# EAGLE design MegaShieldTopMounted (EAGLE 5.11)
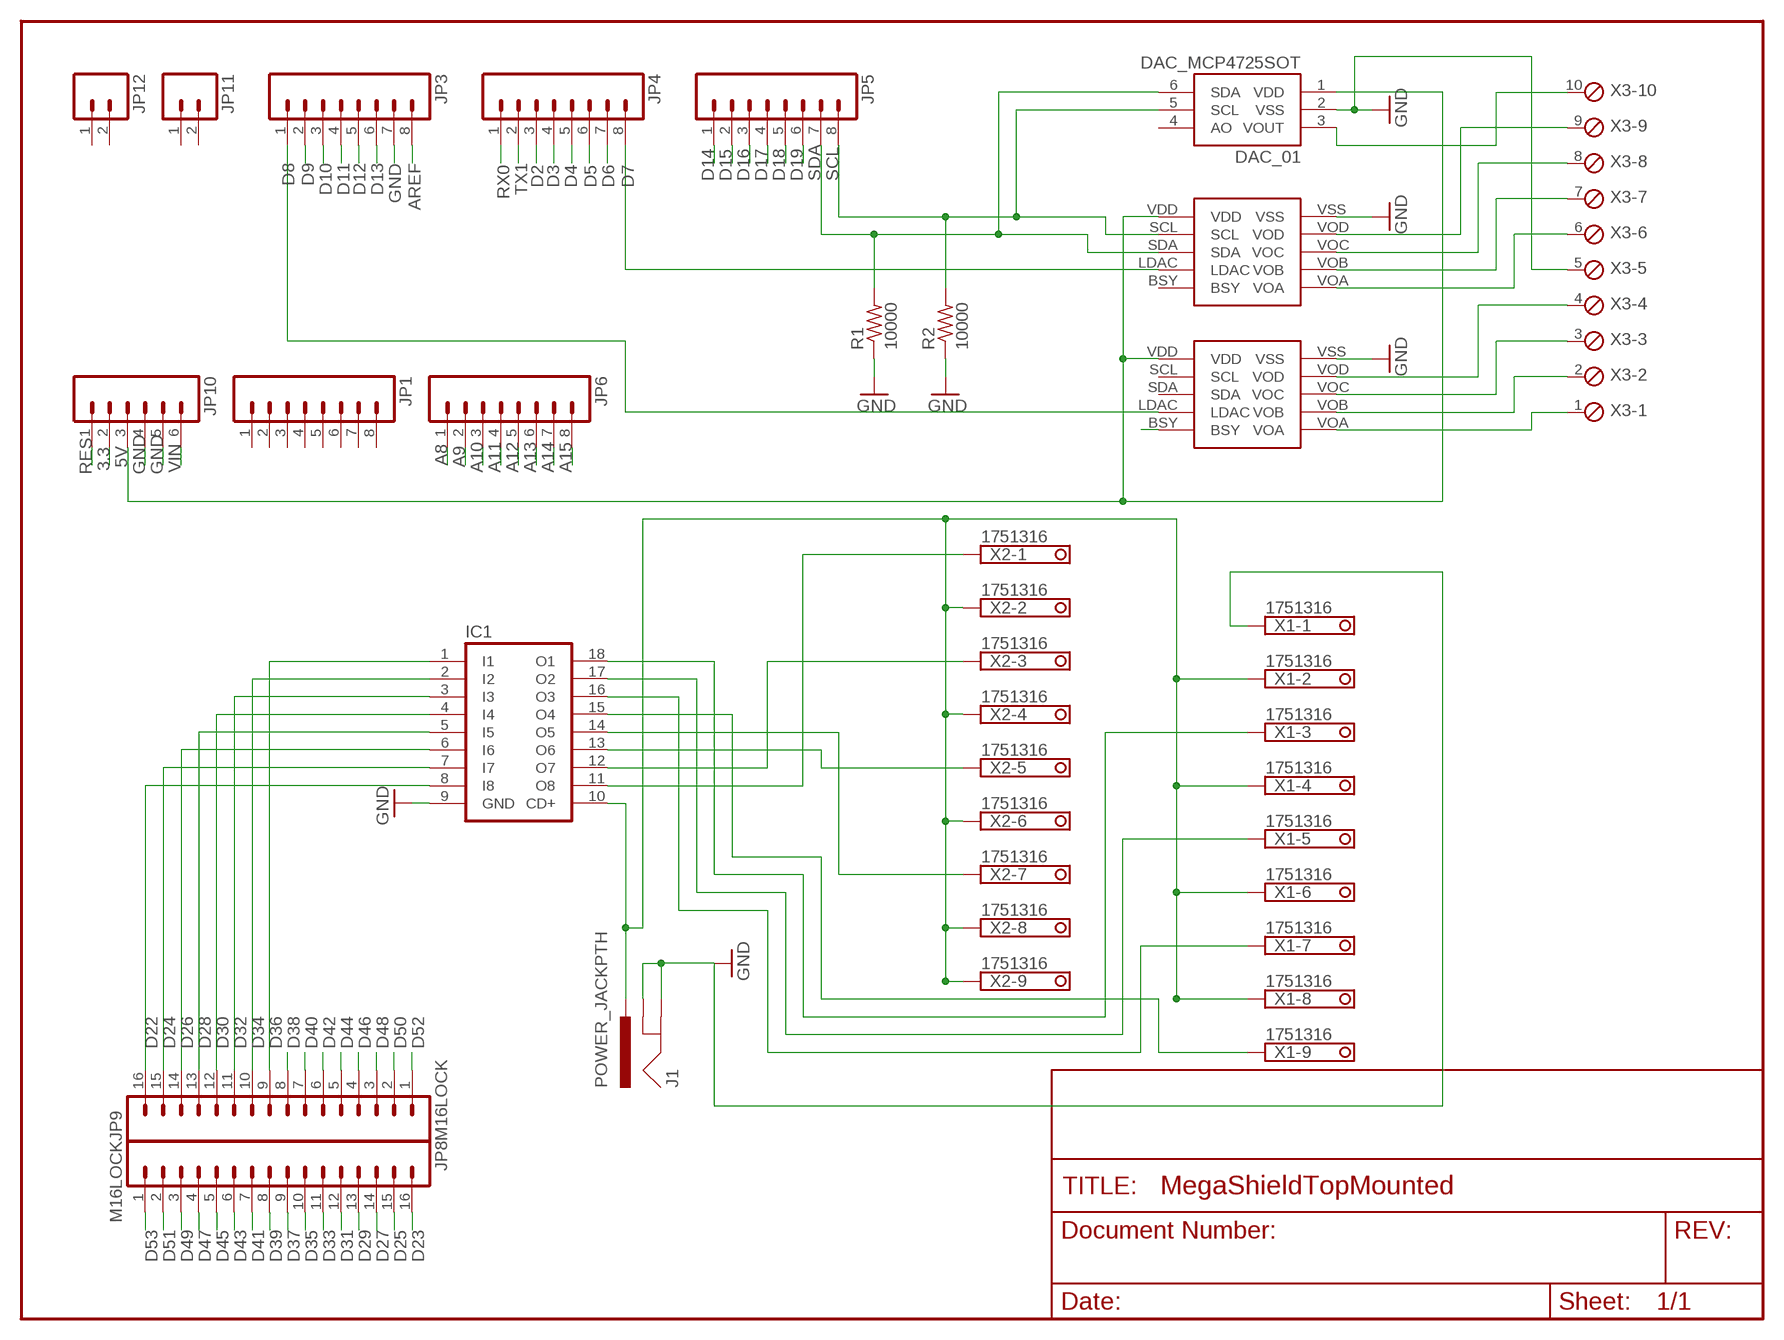
[diagram p0: schematic, sheet 1]

## Parts
DAC_01  DAC_MCP4725SOT  [SOT23-6]
IC1  ULN2803A  [DIL18]
J1  POWER_JACKPTH  [POWER_JACK_PTH]
JP1  M08LOCK  [1X08_LOCK]
JP3  M08LOCK  [1X08_LOCK]
JP4  M08LOCK  [1X08_LOCK]
JP5  M08LOCK  [1X08_LOCK]
JP6  M08LOCK  [1X08_LOCK]
JP8  M16LOCK  [1X16_LOCK]
JP9  M16LOCK  [1X16_LOCK]
JP10  M06LOCK  [1X06_LOCK]
JP11  M02LOCK  [1X02_LOCK]
JP12  M02LOCK  [1X02_LOCK]
R1  10000  R-US_0204/7  [0204/7]
R2  10000  R-US_0204/7  [0204/7]
U$1  MCP4728  [MCP4728]
U$2  MCP4728  [MCP4728]
X1  1751316  [1751316]
X2  1751316  [1751316]
X3  MPT10  [10POL254]

## Nets
3.3: JP10.2
5V: DAC_01.1(VDD) JP10.3 U$1.VDD U$2.VDD
A8: JP6.1
A9: JP6.2
A10: JP6.3
A11: JP6.4
A12: JP6.5
A13: JP6.6
A14: JP6.7
A15: JP6.8
AREF: JP3.8
D2: JP4.3
D3: JP4.4
D4: JP4.5
D5: JP4.6
D6: JP4.7
D7: JP4.8 U$1.LDAC
D8: JP3.1 U$2.LDAC
D9: JP3.2
D10: JP3.3
D11: JP3.4
D12: JP3.5
D13: JP3.6
D14: JP5.1
D15: JP5.2
D16: JP5.3
D17: JP5.4
D18: JP5.5
D19: JP5.6
D22: IC1.8(I8) JP9.16
D23: JP8.16
D24: IC1.7(I7) JP9.15
D25: JP8.15
D26: IC1.6(I6) JP9.14
D27: JP8.14
D28: IC1.5(I5) JP9.13
D29: JP8.13
D30: IC1.4(I4) JP9.12
D31: JP8.12
D32: IC1.3(I3) JP9.11
D33: JP8.11
D34: IC1.2(I2) JP9.10
D35: JP8.10
D36: IC1.1(I1) JP9.9
D37: JP8.9
D38: JP9.8
D39: JP8.8
D40: JP9.7
D41: JP8.7
D42: JP9.6
D43: JP8.6
D44: JP9.5
D45: JP8.5
D46: JP9.4
D47: JP8.4
D48: JP9.3
D49: JP8.3
D50: JP9.2
D51: JP8.2
D52: JP9.1
D53: JP8.1
GND: DAC_01.2(VSS) IC1.9(GND) J1.GND J1.GNDBREAK JP3.7 JP10.4 JP10.5 R1.1 R2.1 U$1.VSS U$2.VSS X1.1 X3.5
N$1: IC1.10(CD+) J1.PWR X1.2 X1.4 X1.6 X1.8 X2.2 X2.4 X2.6 X2.8 X2.9
N$2: IC1.11(O8) X2.1
N$3: IC1.12(O7) X2.3
N$4: IC1.13(O6) X2.5
N$5: IC1.14(O5) X2.7
N$6: U$1.VOD X3.9
N$7: IC1.16(O3) X1.7
N$8: U$1.VOC X3.8
N$9: U$1.VOB X3.7
N$10: U$1.VOA X3.6
N$11: DAC_01.3(VOUT) X3.10
N$15: U$2.VOD X3.4
N$16: U$2.VOC X3.3
N$17: U$2.VOB X3.2
N$18: U$2.VOA X3.1
N$23: U$2.BSY
N$42: IC1.17(O2) X1.5
N$43: IC1.18(O1) X1.3
N$44: IC1.15(O4) X1.9
RES: JP10.1
RX0: JP4.1
SCL: DAC_01.5(SCL) JP5.8 R2.2 U$1.SCL
SDA: DAC_01.6(SDA) JP5.7 R1.2 U$1.SDA
TX1: JP4.2
VIN: JP10.6
Unconnected: DAC_01.4(AO) JP1.1 JP1.2 JP1.3 JP1.4 JP1.5 JP1.6 JP1.7 JP1.8 JP11.1 JP11.2 JP12.1 JP12.2 U$1.BSY U$2.SCL U$2.SDA

## Library data of the parts
DAC_01 = SparkFun:DAC_MCP4725
IC1 = uln-udn:ULN2803A: DRIVER ARRAY
J1 = SparkFun:POWER_JACK: Power Jack This is the standard 5.5mm barrel jack for power. The PTH is the most common, proven, reliable, footprint. All others are experimental. The Slot footprint only works if the mill layer is transmitted to the PCB fab house so be warned. Spark Fun Electronics SKU : PRT-00119. Mating wall wart : TOL-00298 (and others)
JP1 JP3-JP6 = SparkFun:M08: Header 8 Standard 8-pin 0.1" header. Use with straight break away headers (SKU : PRT-00116), right angle break away headers (PRT-00553), swiss pins (PRT-00743), machine pins (PRT-00117), and female headers (PRT-00115).
JP8 JP9 = SparkFun:M16
JP10 = SparkFun:M06: Header 6 Standard 6-pin 0.1" header. Use with straight break away headers (SKU : PRT-00116), right angle break away headers (PRT-00553), swiss pins (PRT-00743), machine pins (PRT-00117), and female headers (PRT-00115). Molex polarized connector foot print use with SKU : PRT-08094 with associated crimp pins and housings. NOTES ON THE VARIANTS LOCK and LOCK_LONGPADS... This footprint was designed to help hold the alignment of a through-hole component (i.e. 6-pin header) while soldering it into place. You may notice that each hole has been shifted either up or down by 0.005 of an inch from it's more standard position (which is a perfectly straight line). This slight alteration caused the pins (the squares in the middle) to touch the edges of the holes. Because they are alternating, it causes a "brace" to hold the component in place. 0.005 has proven to be the perfect amount of "off-center" position when using our standard breakaway headers. Although looks a little odd when you look at the bare footprint, once you have a header in there, the alteration is very hard to notice. Also, if you push a header all the way into place, it is covered up entirely on the bottom side. This idea of altering the position of holes to aid alignment will be further integrated into the Sparkfun Library for other footprints. It can help hold any component with 3 or more connection pins.
JP11 JP12 = SparkFun:M02: Header 2 Standard 2-pin 0.1" header. Use with straight break away headers (SKU : PRT-00116), right angle break away headers (PRT-00553), swiss pins (PRT-00743), machine pins (PRT-00117), and female headers (PRT-00115). Molex polarized connector foot print use with SKU : PRT-08233 with associated crimp pins and housings.
R1 R2 = rcl:R-US_: RESISTOR, American symbol
U$1 U$2 = TravLib:MCP4728
X1 X2 = con-phoenix-350:1751316: MKDS 1/ 9-3,5 Printklemme Nennstrom: 10 A Bemessungsspannung: 160 V Raster: 3,5 mm Polzahl: 9 Montageart: Löten Anschlussart: Schraubanschluss Anschlussrichtung vom Leiter zur Platine: 0° Source: http://eshop.phoenixcontact.com .. 1751316.pdf; OC_FARNELL: unknown; OC_NEWARK: unknown
X3 = con-phoenix-254:MPT10: PHOENIX CONNECTOR; OC_FARNELL: unknown; OC_NEWARK: unknown

## Board
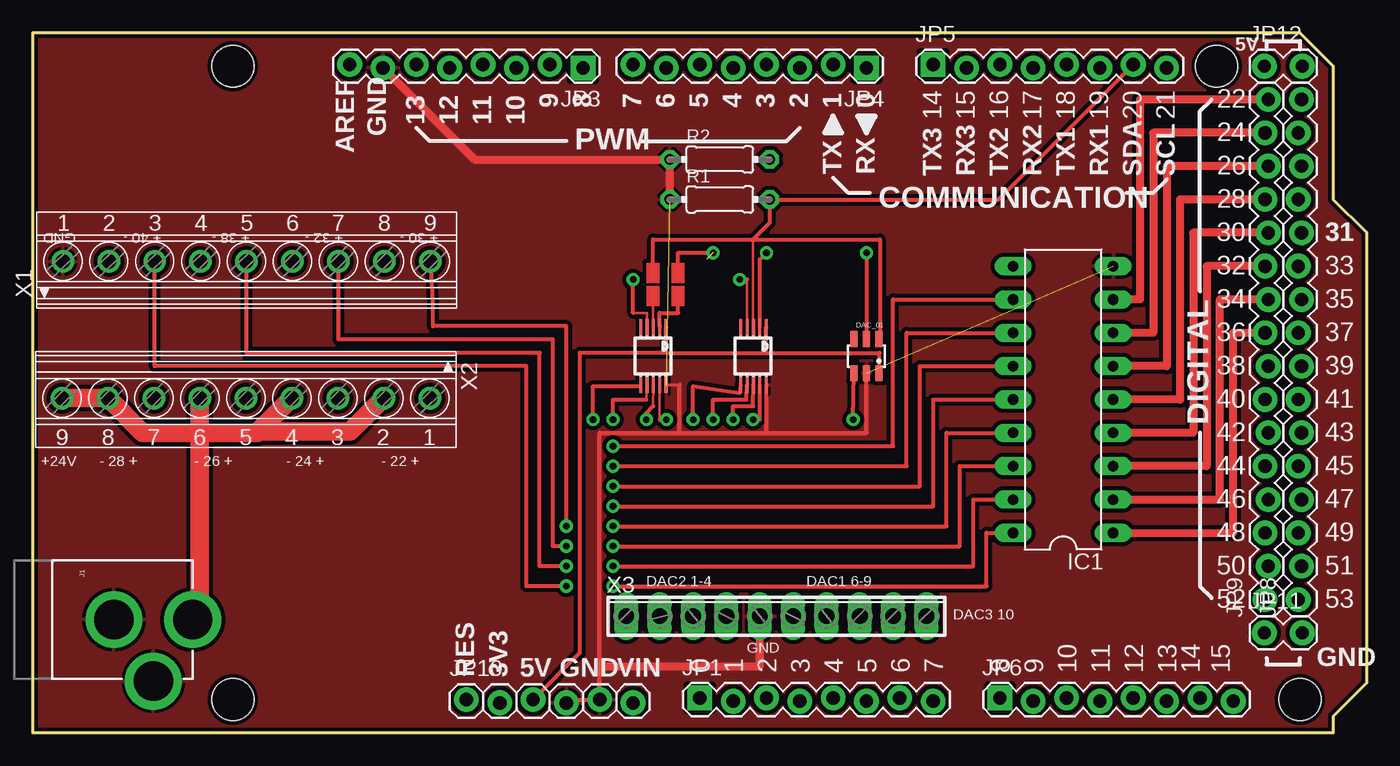
[diagram p1: board, top side]
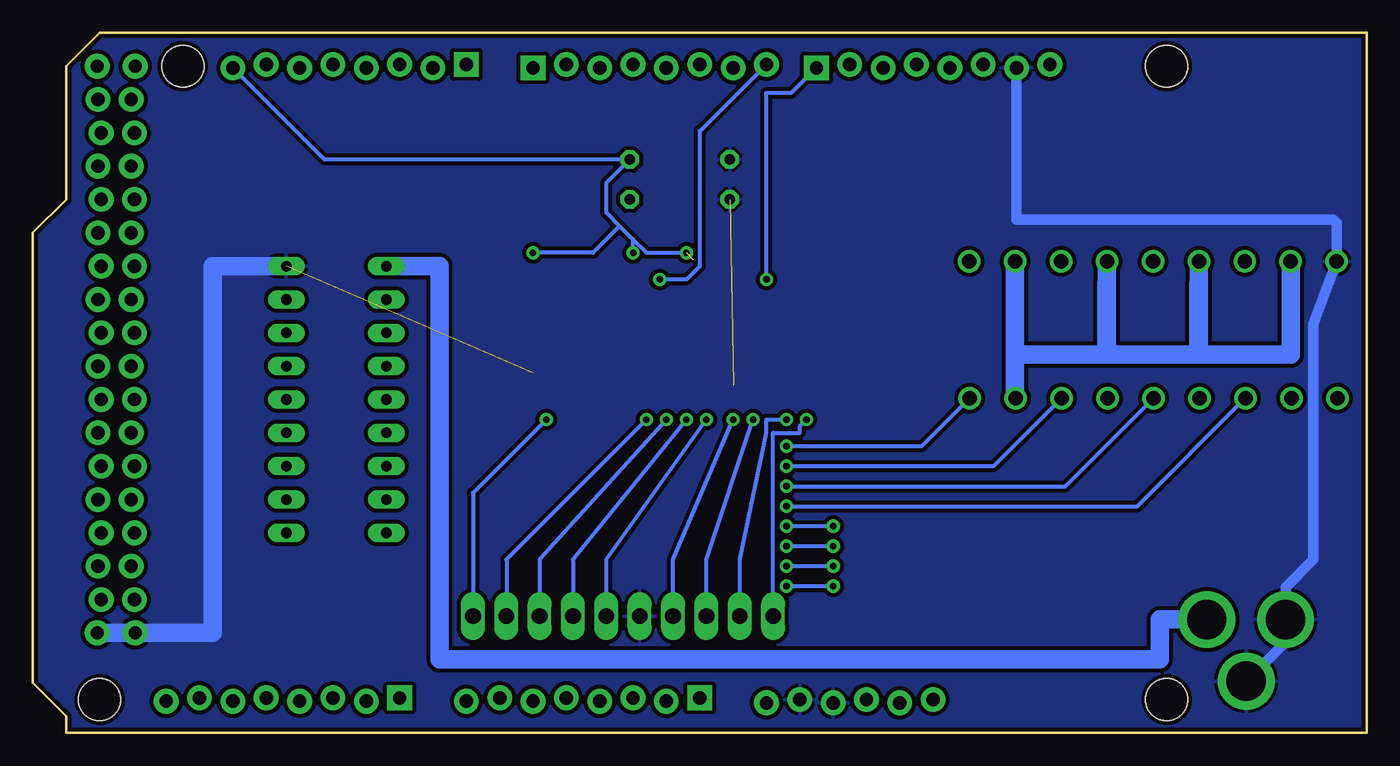
[diagram p2: board, bottom side, seen from below]

Size 101.6 x 53.34 mm. Coordinates in mm from the lower left corner, seen from the top.
Outline: 0,0 99.06,0 99.06,1.27 101.6,3.81 101.6,38.1 99.06,40.64 99.06,50.8 96.52,53.34 0,53.34 0,0
Copper layers (1*16): Top 0.035mm / dielectric 1.5mm / Bottom 0.035mm
Design rules "SparkFun": minimum track width 8mil, minimum drill 20mil, track to track 8mil, track to pad 8mil, pad to pad 8mil, via to via 8mil, smd to smd 8mil, copper to edge 10mil, drill to drill 8mil, minimum pad ring 12mil, minimum via ring 10mil, stop-mask expansion 4mil, vias tented up to drill 25mil, thermal gap 10mil
Holes 3.2 mm at 15.24,50.8 15.24,2.54 90.17,50.8 96.52,2.54

### Footprints (pad centres in the part's own frame; a part is rotated, then mirrored left to right if it is on the bottom)
SOT23-6 = smd 0.55 x 1.2: 1 0.95,-1.3; 2 0,-1.3; 3 -0.95,-1.3; 4 -0.95,1.3; 5 0,1.3; 6 0.95,1.3
DIL18 = drill 0.813 long: 1 -10.16,-3.81; 2 -7.62,-3.81; 3 -5.08,-3.81; 4 -2.54,-3.81; 5 0,-3.81; 6 2.54,-3.81; 7 5.08,-3.81; 8 7.62,-3.81; 9 10.16,-3.81; 10 10.16,3.81; 11 7.62,3.81; 12 5.08,3.81; 13 2.54,3.81; 14 0,3.81; 15 -2.54,3.81; 16 -5.08,3.81; 17 -7.62,3.81; 18 -10.16,3.81
POWER_JACK_PTH = drill 2.997 pad 4.318 round: GND 0,7.7; GNDBREAK 4.7,10.7; PWR 0,13.7
1X08_LOCK = drill 1.016 pad 1.88 square: 1 0,0.127 | drill 1.016 pad 1.88 round: 2 2.54,-0.127; 3 5.08,0.127; 4 7.62,-0.127; 5 10.16,0.127; 6 12.7,-0.127; 7 15.24,0.127; 8 17.78,-0.127
1X16_LOCK = drill 1.016 pad 1.88 round: 1 0,0.127; 2 2.54,-0.127; 3 5.08,0.127; 4 7.62,-0.127; 5 10.16,0.127; 6 12.7,-0.127; 7 15.24,0.127; 8 17.78,-0.127; 9 20.32,0.127; 10 22.86,-0.127; 11 25.4,0.127; 12 27.94,-0.127; 13 30.48,0.127; 14 33.02,-0.127; 15 35.56,0.127; 16 38.1,-0.127
1X06_LOCK = drill 1.016 pad 1.88 round: 1 0,0; 2 2.54,-0.254; 3 5.08,0; 4 7.62,-0.254; 5 10.16,0; 6 12.7,-0.254
1X02_LOCK = drill 1.016 pad 1.88 round: 1 -0.178,0; 2 2.718,0
0204/7 = drill 0.813 octagon: 1 -3.81,0; 2 3.81,0
MCP4728 = smd 1.27 x 0.203: BSY -2.184,-0.94; LDAC -2.184,-0.457; SCL -2.184,0.508; SDA -2.184,0.025; VDD -2.184,0.991; VOA 2.184,-0.94; VOB 2.184,-0.457; VOC 2.184,0.025; VOD 2.184,0.508; VSS 2.184,0.991
1751316 = drill 1.1 pad 1.7 round: 1 -13.973,-0.1; 2 -10.473,-0.1; 3 -6.973,-0.1; 4 -3.473,-0.1; 5 0.028,-0.1; 6 3.527,-0.1; 7 7.027,-0.1; 8 10.527,-0.1; 9 14.027,-0.1
10POL254 = drill 1.2 long: 1 -11.43,0; 2 -8.89,0; 3 -6.35,0; 4 -3.81,0; 5 -1.27,0; 6 1.27,0; 7 3.81,0; 8 6.35,0; 9 8.89,0; 10 11.43,0

### Placement (x,y rotation side)
DAC_01  63.5,28.7 0 top
IC1  78.49,25.4 90 top
J1  -1.52,8.64 270 top
JP1  50.8,2.54 0 top
JP3  41.91,50.8 180 top
JP4  63.5,50.8 180 top
JP5  68.58,50.8 0 top
JP6  73.66,2.54 0 top
JP8  96.52,10.16 90 top
JP9  93.98,10.16 90 top
JP10  33.02,2.54 0 top
JP11  93.98,7.62 0 top
JP12  93.98,50.8 0 top
R1  52.32,40.64 0 top
R2  52.32,43.69 0 top
U$1  54.86,28.7 270 top
U$2  47.24,28.7 270 top
X1  16.26,36.02 0 top
X2  16.26,25.4 180 top
X3  56.64,8.89 0 top

### Tracks (layer width: path | path; a pad name or v marks a point on that pad's centre or on a via)
5V
  Top 0.305: U$2.VDD 48.23,28.98 48.26,28.96 | U$1.VDD 55.85,28.98 55.88,28.96 | 48.26,28.96 55.88,28.96 | DAC_01.1 64.45,28.89 64.52,28.96 55.88,28.96 | 48.26,28.96 41.66,28.96 41.66,6.1 JP10.3
D7  (via drill 0.5 pad 0.25)
  Top 0.203: 54.41,34.54 U$1.LDAC
  Top 0.305: v53.85,34.54 54.41,34.54
  Bottom 0.305: v53.85,34.54 51.82,34.54 50.8,35.56 50.8,45.85 JP4.8
D8  (via drill 0.5 pad 0.25)
  Top 0.203: 45.72,32 46.79,32 U$2.LDAC
  Top 0.305: 45.72,32 v45.72,34.54
  Bottom 0.305: v45.72,34.54 45.72,48.77 43.81,48.77 JP3.1
D22
  Top 0.61: JP9.16 84.33,48.26 84.33,33.02 IC1.8
D24
  Top 0.61: JP9.15 85.34,45.72 85.34,30.48 IC1.7
D26
  Top 0.61: JP9.14 86.36,43.18 86.36,27.94 IC1.6
D28
  Top 0.61: JP9.13 87.38,40.64 87.38,25.4 IC1.5
D30
  Top 0.61: JP9.12 88.39,38.1 88.39,22.86 IC1.4
D32
  Top 0.61: JP9.11 89.41,35.56 89.41,20.32 IC1.3
D34
  Top 0.61: IC1.2 90.42,17.78 90.42,33.02 JP9.10
D36
  Top 0.61: IC1.1 91.44,15.24 91.44,30.48 JP9.9
GND  (2 unrouted)
  Top 0.203: 49.28,26.52 U$2.VSS
  Top 0.305: JP10.4 40.89,2.54 JP10.5 43.18,5.08 43.18,22.86 49.28,22.86 | U$1.VSS 55.88,26.52 55.88,22.86 | DAC_01.2 63.5,22.86 55.88,22.86 | 49.28,22.86 55.88,22.86 | 49.28,22.86 49.28,26.52
  Top 0.61: R1.1 R2.1 33.66,43.69 JP3.7 | X3.5 55.37,5.08 43.18,5.08
  Bottom 0.813: JP3.7 26.67,39.12 2.54,39.12 2.28,38.86 X1.1 4.06,31.14 4.06,13.21 6.18,11.1 J1.GND 6.18,6.94 J1.GNDBREAK
  Bottom 1.422: IC1.9 87.88,35.56 87.88,7.62 96.52,7.62
  pour Bottom (isolate 0.305): 0,0 99.06,0 99.06,1.27 101.6,3.81 101.6,38.1 99.06,40.64 99.06,50.8 96.52,53.34 0,53.34 0,2.54
  pour Top (isolate 0.305): 0,0 99.06,0 99.06,1.27 101.6,3.81 101.6,38.1 99.06,40.64 99.06,50.8 96.52,53.34 0,53.34 0,2.54
N$1
  Top 1.422: J1.PWR 12.73,9.19 12.73,22.86 | 12.73,22.86 X2.6 | 12.73,22.86 8.37,22.86 X2.8 5.63,25.4 5.59,25.4 5.49,25.5 X2.9 | 17.18,22.95 17.09,22.86 12.73,22.86 | 17.18,22.95 X2.4 | X2.2 24.18,22.95 17.18,22.95
  Bottom 1.422: J1.PWR 15.75,8.64 15.75,5.59 70.61,5.59 70.61,35.56 IC1.10 | X2.2 26.78,25.5 X1.8 26.8,32.92 26.8,28.83 19.81,28.83 | 19.81,28.83 19.78,28.83 | 19.78,28.83 X1.6 19.81,32.92 19.81,28.83 | 19.78,28.83 12.83,28.83 | 12.83,28.83 12.78,28.83 | 12.78,28.83 X1.4 12.83,32.92 12.83,28.83 | 12.78,28.83 5.78,28.83 X1.2
N$2  (via drill 0.5 pad 0.25)
  Top 0.305: IC1.11 65.53,33.02 65.53,21.84 v44.2,21.84
  Bottom 0.305: v44.2,21.84 33.88,21.84 X2.1
N$3  (via drill 0.5 pad 0.25)
  Top 0.305: IC1.12 66.55,30.48 66.55,20.32 v44.2,20.32
  Bottom 0.305: v44.2,20.32 28.41,20.32 X2.3
N$4  (via drill 0.5 pad 0.25)
  Top 0.305: IC1.13 67.56,27.94 67.56,18.8 v44.2,18.8
  Bottom 0.305: v44.2,18.8 22.93,18.8 X2.5
N$5  (via drill 0.5 pad 0.25)
  Top 0.305: IC1.14 68.58,25.4 68.58,17.27 v44.2,17.27
  Bottom 0.305: v44.2,17.27 17.46,17.27 X2.7
N$6  (via drill 0.5 pad 0.25)
  Top 0.305: U$1.VOD 55.37,23.88 v54.86,23.88
  Bottom 0.305: v54.86,23.88 65.53,13.21 X3.9
N$7  (via drill 0.5 pad 0.25)
  Top 0.305: IC1.16 70.61,20.32 70.61,14.22 v44.2,14.22 | v40.64,14.22 39.62,14.22 39.62,29.97 23.28,29.97 X1.7
  Bottom 0.305: v40.64,14.22 v44.2,14.22
N$8  (via drill 0.5 pad 0.25)
  Top 0.305: U$1.VOC 54.86,24.89 53.34,24.89 v53.34,23.88
  Bottom 0.305: v53.34,23.88 62.99,13.21 X3.8
N$9  (via drill 0.5 pad 0.25)
  Top 0.305: U$1.VOB 54.36,25.4 51.82,25.4 v51.82,23.88
  Bottom 0.305: v51.82,23.88 60.45,13.21 X3.7
N$10  (via drill 0.5 pad 0.25)
  Top 0.305: v50.29,23.88 50.29,26.42 53.85,25.91 U$1.VOA
  Bottom 0.305: v50.29,23.88 57.91,13.21 X3.6
N$11  (via drill 0.5 pad 0.25)
  Top 0.305: v62.48,23.88 DAC_01.3
  Bottom 0.305: v62.48,23.88 68.07,18.29 X3.10
N$12  (via drill 0.5 pad 0.25)
  Top 0.305: 49.15,35.31 49.15,36.58 v51.82,36.58
N$13  (via drill 0.5 pad 0.25)
  other vias: 55.88,36.58
N$14  (via drill 0.5 pad 0.25)
  other vias: 63.5,36.58
N$15  (via drill 0.5 pad 0.25)
  Top 0.203: U$2.VOD 47.75,23.88
  Top 0.305: v48.26,23.88 47.75,23.88
  Bottom 0.305: v48.26,23.88 52.83,13.21 X3.4
N$16  (via drill 0.5 pad 0.25)
  Top 0.203: 47.24,24.89 U$2.VOC
  Top 0.305: 47.24,24.89 46.74,24.38 v46.74,23.88
  Bottom 0.305: v46.74,23.88 50.29,13.21 X3.3
N$17  (via drill 0.5 pad 0.25)
  Top 0.203: 46.74,25.4 U$2.VOB
  Top 0.305: 46.74,25.4 44.2,25.4 v44.2,23.88
  Bottom 0.305: v44.2,23.88 45.72,23.88 45.72,22.86 47.75,13.21 X3.2
N$18  (via drill 0.5 pad 0.25)
  Top 0.203: 46.2,26.42 U$2.VOA
  Top 0.305: 46.2,26.42 42.67,26.42 v42.67,23.88
  Bottom 0.305: v42.67,23.88 43.18,23.37 43.18,22.86 45.21,22.86 X3.1
N$19  (via drill 0.5 pad 0.25)
  other vias: 45.72,34.54 53.85,34.54
N$22
  Top 0.203: 47.24,31.5 47.24,32.77
N$24
  Top 0.305: 47.75,30.99 47.75,32 49.15,32 49.15,32.89
N$25  (via drill 0.5 pad 0.25)
  other vias: 54.86,23.88
N$26  (via drill 0.5 pad 0.25)
  other vias: 53.34,23.88
N$27  (via drill 0.5 pad 0.25)
  other vias: 51.82,23.88
N$28  (via drill 0.5 pad 0.25)
  other vias: 50.29,23.88
N$29  (via drill 0.5 pad 0.25)
  other vias: 48.26,23.88
N$30  (via drill 0.5 pad 0.25)
  other vias: 46.74,23.88
N$31  (via drill 0.5 pad 0.25)
  other vias: 44.2,23.88
N$32  (via drill 0.5 pad 0.25)
  other vias: 42.67,23.88
N$33  (via drill 0.5 pad 0.25)
  other vias: 62.48,23.88
N$34  (via drill 0.5 pad 0.25)
  other vias: 44.2,21.84
N$35  (via drill 0.5 pad 0.25)
  other vias: 44.2,20.32
N$36  (via drill 0.5 pad 0.25)
  other vias: 44.2,18.8
N$37  (via drill 0.5 pad 0.25)
  other vias: 44.2,17.27
N$38  (via drill 0.5 pad 0.25)
  other vias: 44.2,15.75
N$39  (via drill 0.5 pad 0.25)
  other vias: 44.2,14.22
N$40  (via drill 0.5 pad 0.25)
  other vias: 44.2,12.7
N$41  (via drill 0.5 pad 0.25)
  other vias: 44.2,11.18
N$42  (via drill 0.5 pad 0.25)
  Top 0.305: IC1.17 71.63,17.78 71.63,12.7 v44.2,12.7 | v40.64,12.7 38.61,12.7 38.61,28.96 16.28,28.96 X1.5
  Bottom 0.305: v40.64,12.7 v44.2,12.7
N$43  (via drill 0.5 pad 0.25)
  Top 0.305: IC1.18 72.64,15.24 72.64,11.18 v44.2,11.18 | v40.64,11.18 37.59,11.18 37.59,27.94 9.28,27.94 X1.3
  Bottom 0.305: v40.64,11.18 v44.2,11.18
N$44  (via drill 0.5 pad 0.25)
  Top 0.305: IC1.15 69.6,22.86 69.6,15.75 v44.2,15.75 | v40.64,15.75 40.64,30.99 30.48,30.99 30.48,32.92 X1.9
  Bottom 0.305: v40.64,15.75 v44.2,15.75
N$45  (via drill 0.5 pad 0.25)
  other vias: 40.64,15.75
N$46  (via drill 0.5 pad 0.25)
  other vias: 40.64,14.22
N$47  (via drill 0.5 pad 0.25)
  other vias: 40.64,12.7
N$48  (via drill 0.5 pad 0.25)
  other vias: 40.64,11.18
SCL  (via drill 0.5 pad 0.25)  (1 unrouted)
  Top 0.305: U$1.SCL 55.37,36.07 v55.88,36.58 | v63.5,36.58 DAC_01.5
  Bottom 0.305: JP5.8 79.38,43.69 R2.2 57.91,41.91 57.91,39.62 56.9,38.61 | 55.88,37.59 54.86,36.58 v51.82,36.58 | v55.88,36.58 55.88,37.59 | 55.88,37.59 56.9,38.61 | v63.5,36.58 58.93,36.58 56.9,38.61
SDA
  Top 0.203: 54.86,37.59 54.86,30.89 U$1.SDA
  Top 0.305: 64.52,30 DAC_01.6 | 64.52,30 64.52,29.97 | 64.52,30 64.52,37.59 54.86,37.59 | JP5.7 73.53,40.64 R1.2 56.13,38.86 54.86,37.59 | 47.24,35.18 47.24,37.59 54.86,37.59
(copper drawn outside any net)
  shapes: Top area x5

### Text on the board
tPlace: 5V | 9 | 8 | 7 | 6 | 5 | 4 | 3 | 2 | 1 | 0 | 22 | 14 | 15 | 16 | 17 | 18 | 19 | 20 | 21 | 13 | 12 | 11 | 10 | GND | 24 | AREF | PWM | TX | RX | 26 | TX3 | RX3 | TX2 | RX2 | TX1 | RX1 | SDA | SCL | COMMUNICATION | 28 | GND | + 40 - | + 38 - | + 32 - | + 30 - | 30 | 31 | 32 | 33 | 34 | 35 | 36 | 37 | 38 | 39 | 40 | 41 | DIGITAL | 42 | 43 | +24V | - 28 + | - 26 + | - 24 + | - 22 + | 44 | 45 | 46 | 47 | 48 | 49 | 50 | 51 | DAC2 1-4 | DAC1 6-9 | 52 | 53 | DAC3 10 | GND | 0 | 1 | 2 | 3 | 4 | 5 | 6 | 7 | 8 | 9 | 10 | 11 | 12 | 13 | 14 | 15 | GND | RES | 3V3 | 5V | GND | VIN